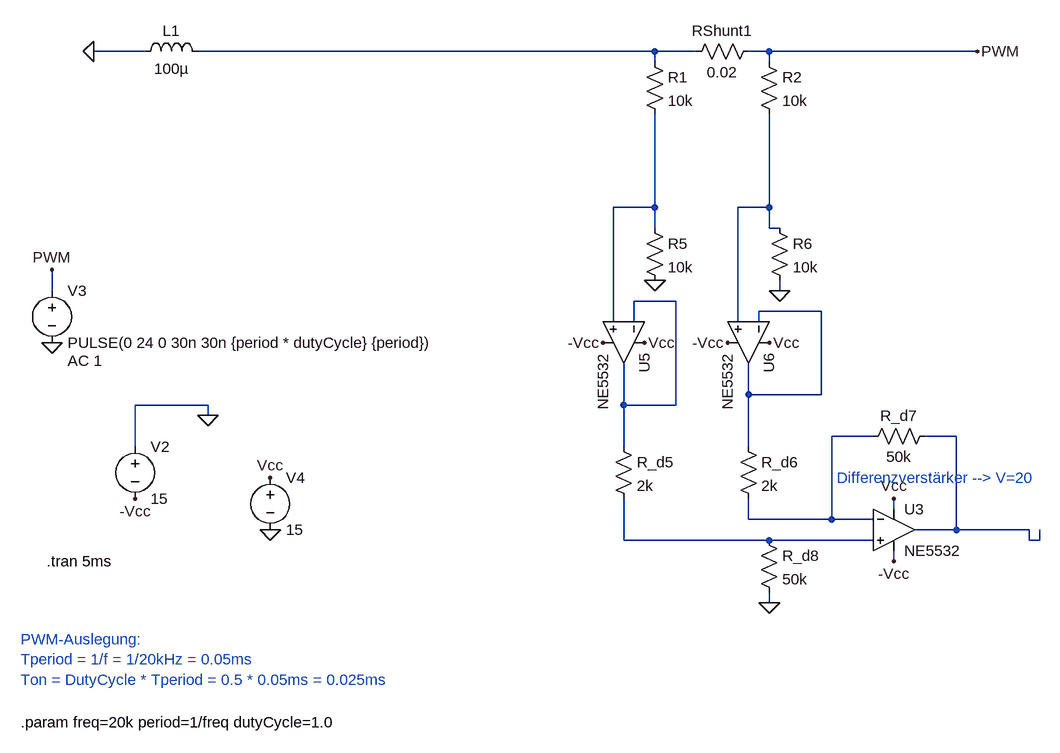
[diagram p0: schematic Differenzverstärker_Variante2.asc]
Differenzverstärker_Variante2.asc, the LTspice schematic file:
Version 4
SHEET 1 1712 928
WIRE -528 -544 -608 -544
WIRE 256 -544 -448 -544
WIRE 320 -544 256 -544
WIRE 432 -544 400 -544
WIRE 752 -544 432 -544
WIRE 256 -528 256 -544
WIRE 432 -528 432 -544
WIRE 256 -304 256 -448
WIRE 256 -304 192 -304
WIRE 432 -304 432 -448
WIRE 432 -304 384 -304
WIRE 256 -272 256 -304
WIRE 432 -272 432 -304
WIRE 448 -272 432 -272
WIRE -672 -176 -672 -208
WIRE 448 -176 448 -192
WIRE 288 -160 224 -160
WIRE 512 -144 416 -144
WIRE 192 -128 192 -304
WIRE 224 -128 224 -160
WIRE 384 -128 384 -304
WIRE 416 -128 416 -144
WIRE 400 -16 400 -64
WIRE 512 -16 512 -144
WIRE 512 -16 400 -16
WIRE -432 0 -544 0
WIRE 208 0 208 -64
WIRE 288 0 288 -160
WIRE 288 0 208 0
WIRE -432 16 -432 0
WIRE 592 48 528 48
WIRE 720 48 672 48
WIRE -544 64 -544 0
WIRE 208 64 208 0
WIRE 400 64 400 -16
WIRE 624 160 624 144
WIRE 400 176 400 144
WIRE 528 176 528 48
WIRE 528 176 400 176
WIRE 592 176 528 176
WIRE 720 192 720 48
WIRE 720 192 656 192
WIRE 832 192 720 192
WIRE 208 208 208 144
WIRE 432 208 208 208
WIRE 592 208 432 208
WIRE 832 208 832 192
WIRE 848 208 848 192
WIRE 848 208 832 208
WIRE 624 240 624 224
WIRE 432 304 432 288
FLAG -608 -544 0
FLAG 752 -544 PWM
FLAG -432 16 0
FLAG -544 144 -Vcc
FLAG -336 192 0
FLAG -336 112 Vcc
FLAG -672 -96 0
FLAG -672 -208 PWM
FLAG 432 304 0
FLAG 624 240 -Vcc
FLAG 624 144 Vcc
FLAG 256 -192 0
FLAG 448 -176 0
FLAG 240 -96 Vcc
FLAG 432 -96 Vcc
FLAG 176 -96 -Vcc
FLAG 368 -96 -Vcc
DATAFLAG 96 -544 ""
DATAFLAG 800 192 ""
DATAFLAG 208 144 ""
DATAFLAG 400 64 ""
SYMBOL ind -432 -528 M270
WINDOW 0 32 56 VTop 2
WINDOW 3 5 56 VBottom 2
SYMATTR InstName L1
SYMATTR Value 100µ
SYMATTR SpiceLine Rser=2.38
SYMBOL res 416 -560 R90
WINDOW 0 0 56 VBottom 2
WINDOW 3 32 56 VTop 2
SYMATTR InstName RShunt1
SYMATTR Value 0.02
SYMBOL voltage -544 48 R0
WINDOW 123 0 0 Left 0
WINDOW 39 0 0 Left 0
SYMATTR InstName V2
SYMATTR Value 15
SYMBOL voltage -336 96 R0
WINDOW 123 0 0 Left 0
WINDOW 39 0 0 Left 0
SYMATTR InstName V4
SYMATTR Value 15
SYMBOL voltage -672 -192 R0
WINDOW 123 24 124 Left 2
WINDOW 39 0 0 Left 0
SYMATTR Value2 AC 1
SYMATTR InstName V3
SYMATTR Value PULSE(0 24 0 30n 30n {period * dutyCycle} {period})
SYMBOL res 240 -544 R0
SYMATTR InstName R1
SYMATTR Value 10k
SYMBOL res 416 -544 R0
SYMATTR InstName R2
SYMATTR Value 10k
SYMBOL res 192 48 R0
SYMATTR InstName R_d5
SYMATTR Value 2k
SYMBOL res 384 48 R0
SYMATTR InstName R_d6
SYMATTR Value 2k
SYMBOL res 688 32 R90
WINDOW 0 0 56 VBottom 2
WINDOW 3 32 56 VTop 2
SYMATTR InstName R_d7
SYMATTR Value 50k
SYMBOL res 416 192 R0
SYMATTR InstName R_d8
SYMATTR Value 50k
SYMBOL res 240 -288 R0
SYMATTR InstName R5
SYMATTR Value 10k
SYMBOL res 432 -288 R0
SYMATTR InstName R6
SYMATTR Value 10k
SYMBOL NE5532 624 128 R0
SYMATTR InstName U3
SYMBOL NE5532 272 -96 R90
SYMATTR InstName U5
SYMBOL NE5532 464 -96 R90
SYMATTR InstName U6
TEXT -680 240 Left 2 !.tran 5ms
TEXT -720 360 Left 2 ;PWM-Auslegung:\nTperiod = 1/f = 1/20kHz = 0.05ms\nTon = DutyCycle * Tperiod = 0.5 * 0.05ms = 0.025ms
TEXT -720 488 Left 2 !.param freq=20k period=1/freq dutyCycle=1.0
TEXT 536 112 Left 2 ;Differenzverstärker --> V=20

The netlist it stands for:
* Differenzverstärker_Variante2.asc
L1 N001 0 100µ Rser=2.38
RShunt1 PWM N001 0.02
V2 0 -Vcc 15
V4 Vcc 0 15
V3 PWM 0 PULSE(0 24 0 30n 30n {period * dutyCycle} {period}) AC 1
R1 N001 N002 10k
R2 PWM N003 10k
R_d5 N004 N008 2k
R_d6 N005 N006 2k
R_d7 N007 N006 50k
R_d8 N008 0 50k
R5 N002 0 10k
R6 N003 0 10k
* U3: NE5532 (symbol NE5532 not available, pins judged from their places): In+=N008 In-=N006 V+=Vcc V-=-Vcc OUT=N007
* U5: NE5532 (symbol NE5532 not available, pins judged from their places): In+=N002 In-=N004 V+=Vcc V-=-Vcc OUT=N004
* U6: NE5532 (symbol NE5532 not available, pins judged from their places): In+=N003 In-=N005 V+=Vcc V-=-Vcc OUT=N005
.tran 5ms
* PWM-Auslegung:
* Tperiod = 1/f = 1/20kHz = 0.05ms
* Ton = DutyCycle * Tperiod = 0.5 * 0.05ms = 0.025ms
.param freq=20k period=1/freq dutyCycle=1.0
* Differenzverstärker --> V=20
.backanno
.end